# Altium schematic sheet Ignition_Injector.SchDoc
size 420 x 297 mm; SheetNumber: 4; SheetTotal: 5
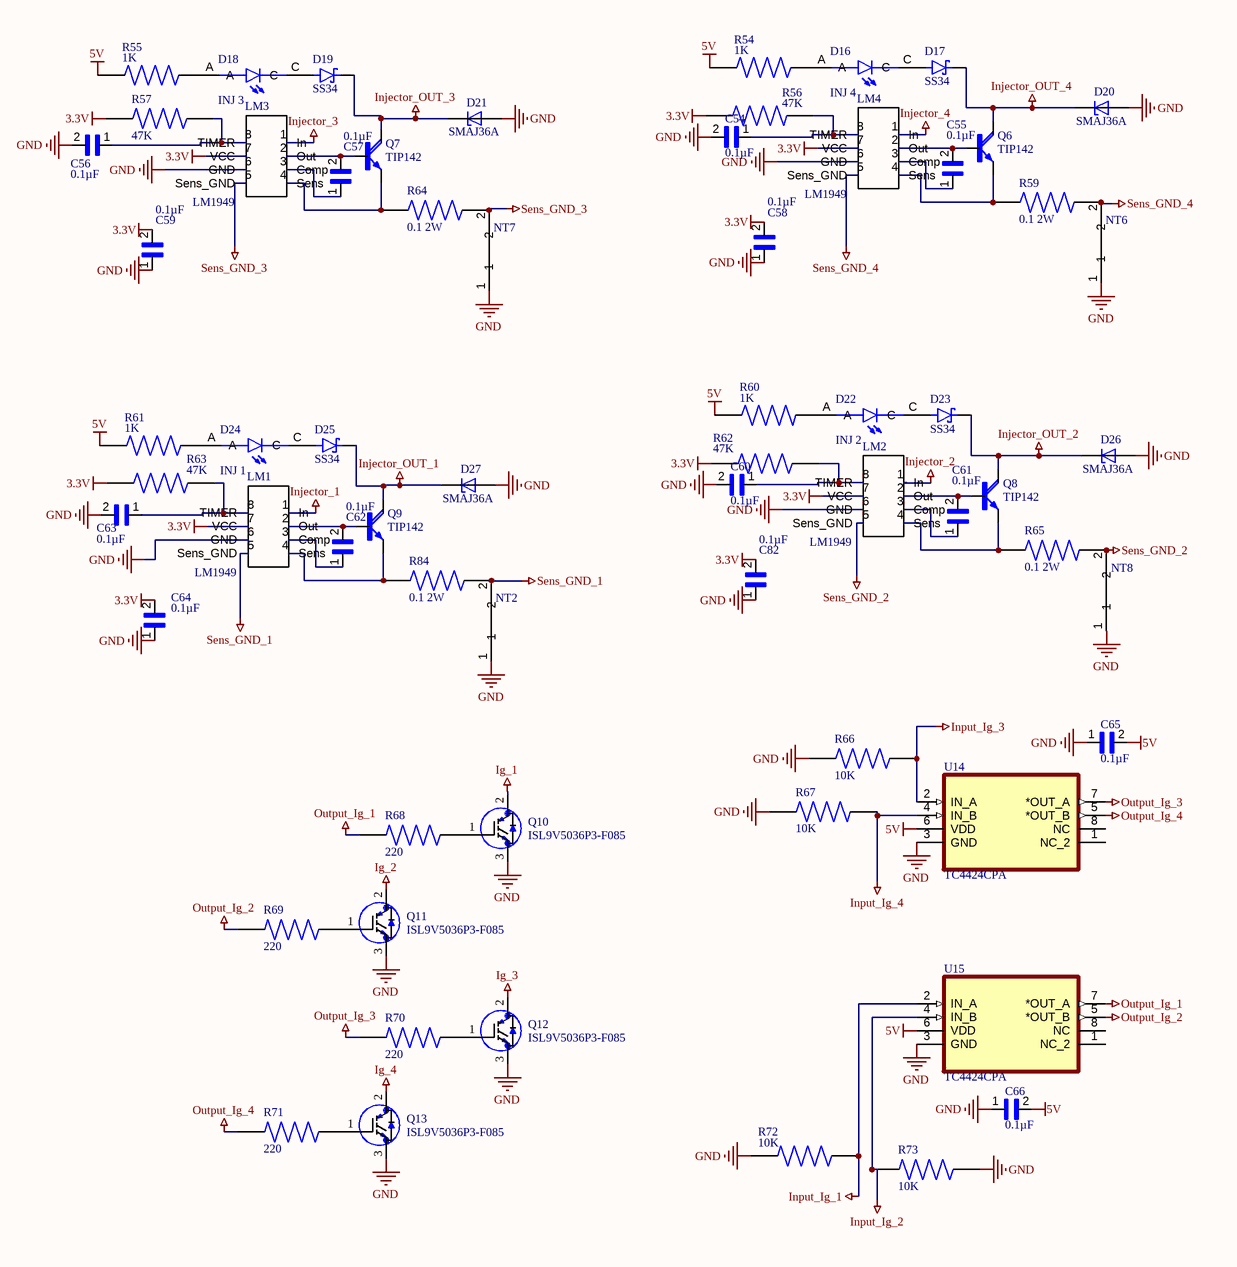
[diagram p0: Ignition_Injector.SchDoc]

## Parts
C54  0.1µF  [CAPC1608X90N]
C55  0.1µF  [CAPC1608X90N]
C56  0.1µF  [CAPC1608X90N]
C57  0.1µF  [CAPC1608X90N]
C58  0.1µF  [CAPC1608X90N]
C59  0.1µF  [CAPC1608X90N]
C60  0.1µF  [CAPC1608X90N]
C61  0.1µF  [CAPC1608X90N]
C62  0.1µF  [CAPC1608X90N]
C63  0.1µF  [CAPC1608X90N]
C64  0.1µF  [CAPC1608X90N]
C65  0.1µF  [CAPC1608X90N]
C66  0.1µF  [CAPC1608X90N]
C82  0.1µF  [CAPC1608X90N]
D16  INJ 4  [LEDC2012X70N]
D17  SS34  [DIO_SS34]
D18  INJ 3  [LEDC2012X70N]
D19  SS34  [DIO_SS34]
D20  SMAJ36A  [DIOM4325X250N]
D21  SMAJ36A  [DIOM4325X250N]
D22  INJ 2  [LEDC2012X70N]
D23  SS34  [DIO_SS34]
D24  INJ 1  [LEDC2012X70N]
D25  SS34  [DIO_SS34]
D26  SMAJ36A  [DIOM4325X250N]
D27  SMAJ36A  [DIOM4325X250N]
LM1  LM1949  [DIP794W45P254L959H508Q8]
LM2  LM1949  [DIP794W45P254L959H508Q8]
LM3  LM1949  [DIP794W45P254L959H508Q8]
LM4  LM1949  [DIP794W45P254L959H508Q8]
NT2  (no value)  [NetTie]  (net tie, no BOM)
NT6  (no value)  [NetTie]  (net tie, no BOM)
NT7  (no value)  [NetTie]  (net tie, no BOM)
NT8  (no value)  [NetTie]  (net tie, no BOM)
Q6  TIP142  [SOT93]
Q7  TIP142  [SOT93]
Q8  TIP142  [SOT93]
Q9  TIP142  [SOT93]
Q10  ISL9V5036P3-F085  [*TO254P470X1016X2019-3P]
Q11  ISL9V5036P3-F085  [*TO254P470X1016X2019-3P]
Q12  ISL9V5036P3-F085  [*TO254P470X1016X2019-3P]
Q13  ISL9V5036P3-F085  [*TO254P470X1016X2019-3P]
R54  1K  [RESC3116X65N]
R55  1K  [RESC3116X65N]
R56  47K  [RESC3116X65N]
R57  47K  [RESC3116X65N]
R59  0.1 2W  [RESC6331X80N]
R60  1K  [RESC3116X65N]
R61  1K  [RESC3116X65N]
R62  47K  [RESC3116X65N]
R63  47K  [RESC3116X65N]
R64  0.1 2W  [RESC6331X80N]
R65  0.1 2W  [RESC6331X80N]
R66  10K  [RESC3116X65N]
R67  10K  [RESC3116X65N]
R68  220  [RES_ERJP08J221V]
R69  220  [RES_ERJP08J221V]
R70  220  [RES_ERJP08J221V]
R71  220  [RES_ERJP08J221V]
R72  10K  [RESC3116X65N]
R73  10K  [RESC3116X65N]
R84  0.1 2W  [RESC6331X80N]
U14  TC4424CPA  [DIP254P762X432-8]
U15  TC4424CPA  [DIP254P762X432-8]

## Nets
3.3V: C58.2 C59.2 C64.2 C82.2 LM1.7(VCC) LM2.7(VCC) LM3.7(VCC) LM4.7(VCC) R56.1 R57.1 R62.1 R63.1
5V: C65.2 C66.2 R54.1 R55.1 R60.1 R61.1 U14.6(VDD) U15.6(VDD)
GND: C54.2 C56.2 C58.1 C59.1 C60.2 C63.2 C64.1 C65.1 C66.1 C82.1 D20.A D21.A D26.A D27.A LM1.6(GND) LM2.6(GND) LM3.6(GND) LM4.6(GND) NT2.1 NT6.1 NT7.1 NT8.1 Q10.3(E) Q11.3(E) Q12.3(E) Q13.3(E) R66.1 R67.1 R72.1 R73.1 U14.3(GND) U15.3(GND)
Ig_1: Q10.2(C)
Ig_2: Q11.2(C)
Ig_3: Q12.2(C)
Ig_4: Q13.2(C)
Injector_1: LM1.1(In)
Injector_2: LM2.1(In)
Injector_3: LM3.1(In)
Injector_4: LM4.1(In)
Injector_OUT_1: D25.C(K) D27.C Q9.C
Injector_OUT_2: D23.C(K) D26.C Q8.C
Injector_OUT_3: D19.C(K) D21.C Q7.C
Injector_OUT_4: D17.C(K) D20.C Q6.C
Input_Ig_1: R72.2 U15.2(IN_A)
Input_Ig_2: R73.2 U15.4(IN_B)
Input_Ig_3: R66.2 U14.2(IN_A)
Input_Ig_4: R67.2 U14.4(IN_B)
Output_Ig_1: R68.1 U15.7(*OUT_A)
Output_Ig_2: R69.1 U15.5(*OUT_B)
Output_Ig_3: R70.1 U14.7(*OUT_A)
Output_Ig_4: R71.1 U14.5(*OUT_B)
Sens_GND_1: LM1.5(Sens_GND) NT2.2 R84.2
Sens_GND_2: LM2.5(Sens_GND) NT8.2 R65.2
Sens_GND_3: LM3.5(Sens_GND) NT7.2 R64.1
Sens_GND_4: LM4.5(Sens_GND) NT6.2 R59.2
NetC54_1: C54.1 LM4.8(TIMER) R56.2
NetC55_1: C55.1 LM4.3(Comp)
NetC55_2: C55.2 LM4.2(Out) Q6.B
NetC56_1: C56.1 LM3.8(TIMER) R57.2
NetC57_1: C57.1 LM3.3(Comp)
NetC57_2: C57.2 LM3.2(Out) Q7.B
NetC60_1: C60.1 LM2.8(TIMER) R62.2
NetC61_1: C61.1 LM2.3(Comp)
NetC61_2: C61.2 LM2.2(Out) Q8.B
NetC62_1: C62.1 LM1.3(Comp)
NetC62_2: C62.2 LM1.2(Out) Q9.B
NetC63_1: C63.1 LM1.8(TIMER) R63.2
NetD16_A: D16.A R54.2
NetD16_C: D16.C D17.A
NetD18_A: D18.A R55.2
NetD18_C: D18.C D19.A
NetD22_A: D22.A R60.2
NetD22_C: D22.C D23.A
NetD24_A: D24.A R61.2
NetD24_C: D24.C D25.A
NetLM1_4: LM1.4(Sens) Q9.E R84.1
NetLM2_4: LM2.4(Sens) Q8.E R65.1
NetLM3_4: LM3.4(Sens) Q7.E R64.2
NetLM4_4: LM4.4(Sens) Q6.E R59.1
NetQ10_1: Q10.1(G) R68.2
NetQ11_1: Q11.1(G) R69.2
NetQ12_1: Q12.1(G) R70.2
NetQ13_1: Q13.1(G) R71.2

Not connected (* = marked no-connect by the designer): U14 1(NC_2) 8(NC); U15 1(NC_2) 8(NC)

## Notes on the sheet
- THIS DOCUMENT AND THE DATA DISCLOSED HEREIN OR
- HEREWITH IS THE PROPERTY OF ALTIUM LIMITED AND MAY
- DWG NO:
- REVISION
- REV:
- DESCRIPTION
- DATE
- APPROVED
- BE FREELY DISTRIBUTED IN WHOLE. NO RIGHTS ARE
- RESERVED OR EXPRESS OR IMPLIED WARANTEE GIVEN.
- ENG:
- APPROVALS
- PROJECT
- DSN:
- CHK:
- REFERENCE DOCUMENTS
- PROJECT REVISION:
- TITLE
- DOCUMENT REVISION:
- DESIGN ITEM:
- BOM:
- FAB DWG:
- PCB DWG:
- ASSY DWG:
- SCALE:
- A3
- SIZE
- CAGE CODE
- FILE NAME
- DWG NO.
- SHEET
- OF
- REV

## Library data of the parts
C54-C66 C82 = 06035C104MAZ2A: Multilayer Ceramic Capacitors MLCC - SMD/SMT; Package: None; Price: None; Value: *; MP: 06035C104MAZ2A; Availability: Unavailable
D16 D18 D22 D24 = 597-3305-607F: LED Uni-Color Green 4-Pin Chip 0805 T/R; Availability: Unavailable; Value: *; Price: None; MP: 597-3305-607F; Package: None
D17 D19 D23 D25 = SS34: 3A, 40V, Schottky Rectifier; MF: Taiwan Semiconductor; SnapEDA_Link: https://www.snapeda.com/parts/SS34/Taiwan+Semiconductor/view-part/?ref=snap; Package: DO-214AB-2 Taiwan Semiconductor; Value: *; MP: SS34; Check_prices: https://www.snapeda.com/parts/SS34/Taiwan+Semiconductor/view-part/?ref=eda
D20 D21 D26 D27 = SMAJ36A: 400W Surface Mount Transient Voltage Supressors | Littelfuse SMAJ36A; SnapEDA_Link: https://www.snapeda.com/parts/SMAJ36A/Littelfuse/view-part/?ref=snap; Package: DO-214 Bourns; Value: *; MF: Littelfuse; MP: SMAJ36A; Check_prices: https://www.snapeda.com/parts/SMAJ36A/Littelfuse/view-part/?ref=eda
LM1-LM4 = Component_1
NT2 NT6-NT8 = NT
Q6-Q9 = TIP142: Bipolar (BJT) Transistor NPN - Darlington 100 V 10 A - 125 W Through Hole TO-247-3; MF: ON Semiconductor; SnapEDA_Link: https://www.snapeda.com/parts/TIP142/Onsemi/view-part/?ref=snap; Package: SOT-93-3 ON Semiconductor; Value: *; MP: TIP142; Check_prices: https://www.snapeda.com/parts/TIP142/Onsemi/view-part/?ref=eda
R54 R55 R60 R61 = RC1206JR-071KL: RES, THICK FILM, 1K, 5%, 0.25W, 1206; Resistance:1kohm; Resistance Tolerance:Â± 5%; Power Rating:250mW; Resistor Case Style:1206 ^3216 Metric]; Resistor Technology:Thick Film; Resistor Type:General Purpose; Product Range:RC Series; MF: Yageo Corporation; MP: RC1206JR071KL; SnapEDA_Link: https://www.snapeda.com/parts/RC1206JR071KL/Yageo/view-part/?ref=snap; Package: 1206-2 YAGEO; Value: *; Check_prices: https://www.snapeda.com/parts/RC1206JR071KL/Yageo/view-part/?ref=eda
R56 R57 R62 R63 R66 R67 R72 R73 = AA1206JR-07470RL: Package: None; Price: None; Value: *; MP: AA1206JR-07470RL; Availability: Unavailable
R59 R64 R65 R84 = CRM2512-JX-R100ELF: Resistor,Thick Film,Res 0.1 Ohms,Pwr-Rtg 2 W,Tol 5%,SMT,2512 | Bourns CRM2512-JX-R100ELF; SnapEDA_Link: https://www.snapeda.com/parts/CRM2512-JX-R100ELF/Bourns/view-part/?ref=snap; Package: 6331 Bourns; Value: *; MF: Bourns; MP: CRM2512-JX-R100ELF; Check_prices: https://www.snapeda.com/parts/CRM2512-JX-R100ELF/Bourns/view-part/?ref=eda
R68-R71 = ERJP08J221V: Value: *; Price: None; Availability: Unavailable; Package: None; MP: ERJP08J221V
U14 U15 = TC4424CPA: Dual MOSFET Power Driver 3A 4.5 to 18V Non-Inverting 8-Pin PDIP | Microchip Technology Inc. TC4424CPA; SnapEDA_Link: https://www.snapeda.com/parts/TC4424CPA/Microchip/view-part/?ref=snap; Package: DIP-8 Microchip; Value: *; MF: Microchip; MP: TC4424CPA; Check_prices: https://www.snapeda.com/parts/TC4424CPA/Microchip/view-part/?ref=eda
Q10-Q13 = ISL9V5036P3-F085: SnapEDA_Link: https://www.snapeda.com/parts/ISL9V5036P3-F085/Onsemi/view-part/?ref=snap; Check_prices: https://www.snapeda.com/parts/ISL9V5036P3-F085/Onsemi/view-part/?ref=eda; Value: *